# Altium schematic sheet Cook_It.SchDoc
size A; SheetNumber: 1; SheetTotal: 3
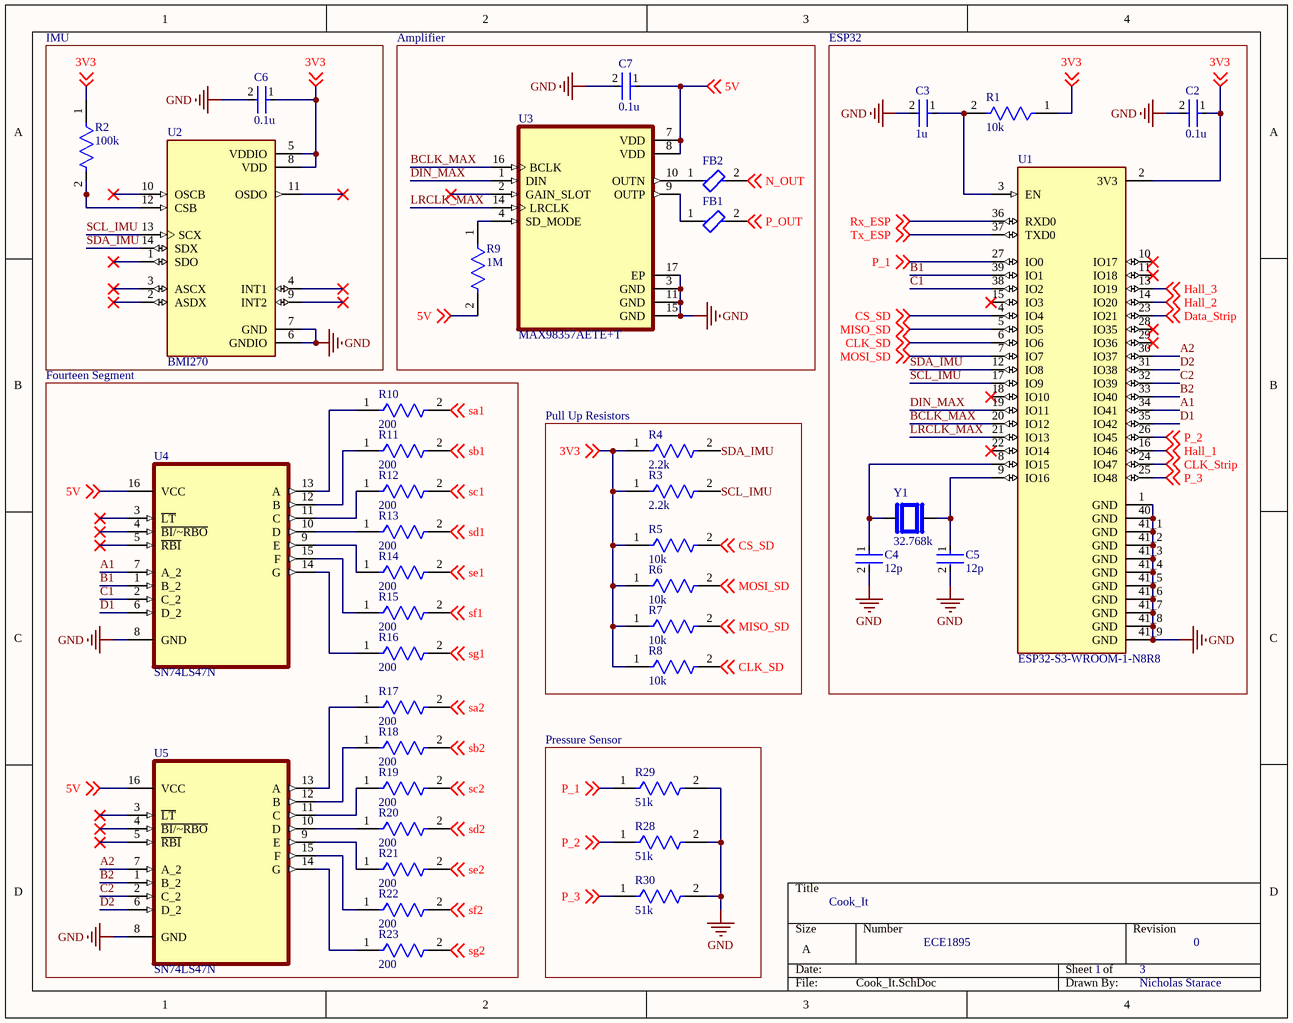
[diagram p0: Cook_It.SchDoc]

## Parts
C2  0.1u  [FP-GRM21B-0_2-e0_2_0_7-IPC_B]
C3  1u  [FP-GRM21B-0_2-e0_2_0_7-IPC_B]
C4  12p  [FP-GRM21B-0_2-e0_2_0_7-IPC_B]
C5  12p  [FP-GRM21B-0_2-e0_2_0_7-IPC_B]
C6  0.1u  [FP-GRM21B-0_2-e0_2_0_7-IPC_B]
C7  0.1u  [FP-GRM21B-0_2-e0_2_0_7-IPC_B]
FB1  (no value)  [FP-BMB2A1000LN2-IPC_C]
FB2  (no value)  [FP-BMB2A1000LN2-IPC_C]
R1  10k  [FP-TFCR0805-IPC_B]
R2  100k  [FP-TFCR0805-IPC_B]
R3  2.2k  [FP-TFCR0805-IPC_B]
R4  2.2k  [FP-TFCR0805-IPC_B]
R5  10k  [FP-TFCR0805-IPC_B]
R6  10k  [FP-TFCR0805-IPC_B]
R7  10k  [FP-TFCR0805-IPC_B]
R8  10k  [FP-TFCR0805-IPC_B]
R9  1M  [FP-TFCR0805-IPC_B]
R10  200  [FP-TFCR0805-MFG]
R11  200  [FP-TFCR0805-MFG]
R12  200  [FP-TFCR0805-MFG]
R13  200  [FP-TFCR0805-MFG]
R14  200  [FP-TFCR0805-MFG]
R15  200  [FP-TFCR0805-MFG]
R16  200  [FP-TFCR0805-MFG]
R17  200  [FP-TFCR0805-MFG]
R18  200  [FP-TFCR0805-MFG]
R19  200  [FP-TFCR0805-MFG]
R20  200  [FP-TFCR0805-MFG]
R21  200  [FP-TFCR0805-MFG]
R22  200  [FP-TFCR0805-MFG]
R23  200  [FP-TFCR0805-MFG]
R28  51k  [FP-TFCR0805-IPC_B]
R29  51k  [FP-TFCR0805-IPC_B]
R30  51k  [FP-TFCR0805-IPC_B]
U1  ESP32-S3-WROOM-1-N8R8  [XCVR_ESP32S3WROOM1N8R8]
U2  BMI270  [XDCR_BMI270]
U3  MAX98357AETE+T  [QFN50P300X300X80-17N]
U4  SN74LS47N  [SOIC127P600X175-16N]
U5  SN74LS47N  [SOIC127P600X175-16N]
Y1  32.768k  [XTAL_ABS07-32.768KHZ-T]

## Blocks framed on the sheet
IMU: C6 R2 U2
Amplifier: C7 FB1 FB2 R9 U3
ESP32: C2-C5 R1 U1 Y1
Fourteen Segment: R10-R23 U4 U5
Pull Up Resistors: R3-R8
Pressure Sensor: R28-R30

## Nets
GND: C2.2 C3.2 C4.2 C5.2 C6.2 C7.2 R28.2 R29.2 R30.2 U1.1(GND) U1.40(GND) U1.41_1(GND) U1.41_2(GND) U1.41_3(GND) U1.41_4(GND) U1.41_5(GND) U1.41_6(GND) U1.41_7(GND) U1.41_8(GND) U1.41_9(GND) U2.6(GNDIO) U2.7(GND) U3.3(GND) U3.11(GND) U3.15(GND) U3.17(EP) U4.8(GND) U5.8(GND)
3V3: C2.1 C6.1 R1.1 R2.1 R3.1 R4.1 R5.1 R6.1 R7.1 R8.1 U1.2(3V3) U2.5(VDDIO) U2.8(VDD) ; off-sheet 3V3
5V: C7.1 R9.2 U3.7(VDD) U3.8(VDD) U4.16(VCC) U5.16(VCC) ; off-sheet 5V
A1: U1.34(IO41) U4.7(A_2)
A2: U1.30(IO37) U5.7(A_2)
B1: U1.39(IO1) U4.1(B_2)
B2: U1.33(IO40) U5.1(B_2)
BCLK_MAX: U1.20(IO12) U3.16(BCLK)
C1: U1.38(IO2) U4.2(C_2)
C2: U1.32(IO39) U5.2(C_2)
CLK_SD: R8.2 U1.6(IO6) ; off-sheet CLK_SD
CLK_Strip: U1.24(IO47) ; off-sheet CLK_Strip
CS_SD: R5.2 U1.4(IO4) ; off-sheet CS_SD
D1: U1.35(IO42) U4.6(D_2)
D2: U1.31(IO38) U5.6(D_2)
Data_Strip: U1.23(IO21) ; off-sheet Data_Strip
DIN_MAX: U1.19(IO11) U3.1(DIN)
Hall_1: U1.16(IO46) ; off-sheet Hall_1
Hall_2: U1.14(IO20) ; off-sheet Hall_2
Hall_3: U1.13(IO19) ; off-sheet Hall_3
LRCLK_MAX: U1.21(IO13) U3.14(LRCLK)
MISO_SD: R7.2 U1.5(IO5) ; off-sheet MISO_SD
MOSI_SD: R6.2 U1.7(IO7) ; off-sheet MOSI_SD
N_OUT: FB2.2 ; off-sheet N_OUT
P_1: R29.1 U1.27(IO0) ; off-sheet P_1
P_2: R28.1 U1.26(IO45) ; off-sheet P_2
P_3: R30.1 U1.25(IO48) ; off-sheet P_3
P_OUT: FB1.2 ; off-sheet P_OUT
Rx_ESP: U1.36(RXD0) ; off-sheet Rx_ESP
sa1: R10.2 ; off-sheet sa1
sa2: R17.2 ; off-sheet sa2
sb1: R11.2 ; off-sheet sb1
sb2: R18.2 ; off-sheet sb2
sc1: R12.2 ; off-sheet sc1
sc2: R19.2 ; off-sheet sc2
SCL_IMU: R3.2 U1.17(IO9) U2.13(SCX)
sd1: R13.2 ; off-sheet sd1
sd2: R20.2 ; off-sheet sd2
SDA_IMU: R4.2 U1.12(IO8) U2.14(SDX)
se1: R14.2 ; off-sheet se1
se2: R21.2 ; off-sheet se2
sf1: R15.2 ; off-sheet sf1
sf2: R22.2 ; off-sheet sf2
sg1: R16.2 ; off-sheet sg1
sg2: R23.2 ; off-sheet sg2
Tx_ESP: U1.37(TXD0) ; off-sheet Tx_ESP
NetC3_1: C3.1 R1.2 U1.3(EN)
NetC4_1: C4.1 U1.8(IO15) Y1.2
NetC5_1: C5.1 U1.9(IO16) Y1.1
NetFB1_1: FB1.1 U3.9(OUTP)
NetFB2_1: FB2.1 U3.10(OUTN)
NetR2_2: R2.2 U2.12(CSB)
NetR9_1: R9.1 U3.4(SD_MODE)
NetR10_1: R10.1 U4.13(A)
NetR11_1: R11.1 U4.12(B)
NetR12_1: R12.1 U4.11(C)
NetR13_1: R13.1 U4.10(D)
NetR14_1: R14.1 U4.9(E)
NetR15_1: R15.1 U4.15(F)
NetR16_1: R16.1 U4.14(G)
NetR17_1: R17.1 U5.13(A)
NetR18_1: R18.1 U5.12(B)
NetR19_1: R19.1 U5.11(C)
NetR20_1: R20.1 U5.10(D)
NetR21_1: R21.1 U5.9(E)
NetR22_1: R22.1 U5.15(F)
NetR23_1: R23.1 U5.14(G)

Not connected (* = marked no-connect by the designer): U1 10(IO17)* 11(IO18)* 15(IO3)* 18(IO10)* 22(IO14)* 28(IO35)* 29(IO36)*; U2 1(SDO)* 2(ASDX)* 3(ASCX)* 4(INT1)* 9(INT2)* 10(OSCB)* 11(OSDO)*; U3 2(GAIN_SLOT)*; U4 3(~{LT})* 4(~{BI/~RBO})* 5(~{RBI})*; U5 3(~{LT})* 4(~{BI/~RBO})* 5(~{RBI})*

## Notes on the sheet
- Cook_It
- ECE1895
- 1
- 3
- 0
- Nicholas Starace

## Library data of the parts
C2-C7 = CMP-06035-063309-1: CAP CER 2.2UF 100V X7T 0805
FB1 FB2 = CMP-03232-000001-1: FERRITE BEAD 1 KOHM 0805 1LN; Tolerance: 25%; Lead/Base Style: SMD/SMT; Max DC Current: 350mA; Number of Lines: 1; Impedance: 1kR; DC Resistance (DCR): 300mR; Resistor Type: Ferrite Bead; Depth: 1.4mm; Height: 1.1mm; Case/Package: 0805; Number of Pins: 2; Case Code (Imperial): 0805; ELV: Compliant; Packaging: Tape and Reel; Mount: Surface Mount; Max Current Rating: 350mA; Max Operating Temperature: 125°C; Series: BMB-L; Core Material: Ferrite; Min Operating Temperature: -55°C; RoHS Compliant: Yes; Case Code (Metric): 2012
R1-R9 R28-R30 = CMP-250906-214896-1: RES Thin Film,  499kΩ, 0.1%, 0.125W, 25ppm/°C, 0805
R10-R23 = CMP-250906-142014-1: RES Thin Film,  1.72kΩ, 1%, 0.125W, 25ppm/°C, 0805
U1 = ESP32-S3-WROOM-1-N8R8: Bluetooth, WiFi 802.11b/g/n, Bluetooth v5.0 Transceiver Module 2.4GHz PCB Trace Surface Mount; MF: Espressif Systems; Package: None; Price: None; Check_prices: https://www.snapeda.com/parts/ESP32-S3-WROOM-1-N8R8/Espressif+Systems/view-part/?ref=eda; Value: *; SnapEDA_Link: https://www.snapeda.com/parts/ESP32-S3-WROOM-1-N8R8/Espressif+Systems/view-part/?ref=snap; MP: ESP32-S3-WROOM-1-N8R8; Availability: In Stock; Purchase-URL: https://pricing.snapeda.com/search?q=ESP32-S3-WROOM-1-N8R8&ref=eda
U2 = BMI270: Accelerometer, Gyroscope, 6 Axis Sensor IÂ²C, SPI Output; MF: Bosch Sensortec; Digi-Key_Part_Number: 828-1091-2-ND; Check_prices: https://www.snapeda.com/parts/BMI270/Bosch+Sensortec/view-part/?ref=eda; MP: BMI270; Package: LGA-14 Bosch Sensortec; SnapEDA_Link: https://www.snapeda.com/parts/BMI270/Bosch+Sensortec/view-part/?ref=snap; Value: *; Purchase-URL: https://pricing.snapeda.com/search/part/BMI270/?ref=eda
U3 = MAX98357AETE+T: Tiny, Low-Cost, PCM Class D Amplifier with Class AB Performance; MF: Analog Devices; SnapEDA_Link: https://www.snapeda.com/parts/MAX98357AETE+T/Analog+Devices/view-part/?ref=snap; Package: TQFN-16 Maxim; Value: *; MP: MAX98357AETE+T; Check_prices: https://www.snapeda.com/parts/MAX98357AETE+T/Analog+Devices/view-part/?ref=eda
U4 U5 = SN74LS47N: Decoder/Driver Single 4-to-7 16-Pin PDIP Tube; MF: onsemi; SnapEDA_Link: https://www.snapeda.com/parts/SN74LS47N/Onsemi/view-part/?ref=snap; Package: None; Value: *; MP: SN74LS47N; Check_prices: https://www.snapeda.com/parts/SN74LS47N/Onsemi/view-part/?ref=eda
Y1 = ABS07-32.768KHZ-T: 32.768 kHz Â±20ppm Crystal 12.5pF 70 kOhms 2-SMD, No Lead; MF: Abracon; Availability: In Stock; SnapEDA_Link: https://www.snapeda.com/parts/ABS07-32.768KHZ-T/Abracon+LLC/view-part/?ref=snap; MP: ABS07-32.768KHZ-T; Price: None; Value: *; Check_prices: https://www.snapeda.com/parts/ABS07-32.768KHZ-T/Abracon+LLC/view-part/?ref=eda; Purchase-URL: https://pricing.snapeda.com/search/part/ABS07-32.768KHZ-T/?ref=eda; Package: SMD-2 Abracon LLC